# EAGLE design Pi3-Motherboard (EAGLE 7.6.0)

## Sheet 1 of 5
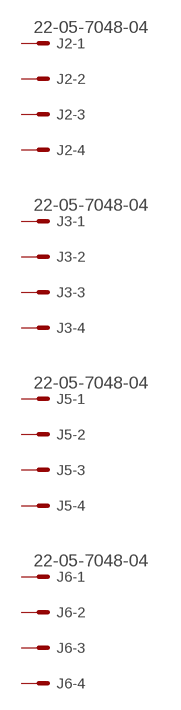
[diagram p0: schematic, sheet 1]

### Parts
J2  22-05-7048-04  [7395-04]
J3  22-05-7048-04  [7395-04]
J5  22-05-7048-04  [7395-04]
J6  22-05-7048-04  [7395-04]
Unconnected: J2.1 J2.2 J2.3 J2.4 J3.1 J3.2 J3.3 J3.4 J5.1 J5.2 J5.3 J5.4 J6.1 J6.2 J6.3 J6.4

## Sheet 2 of 5
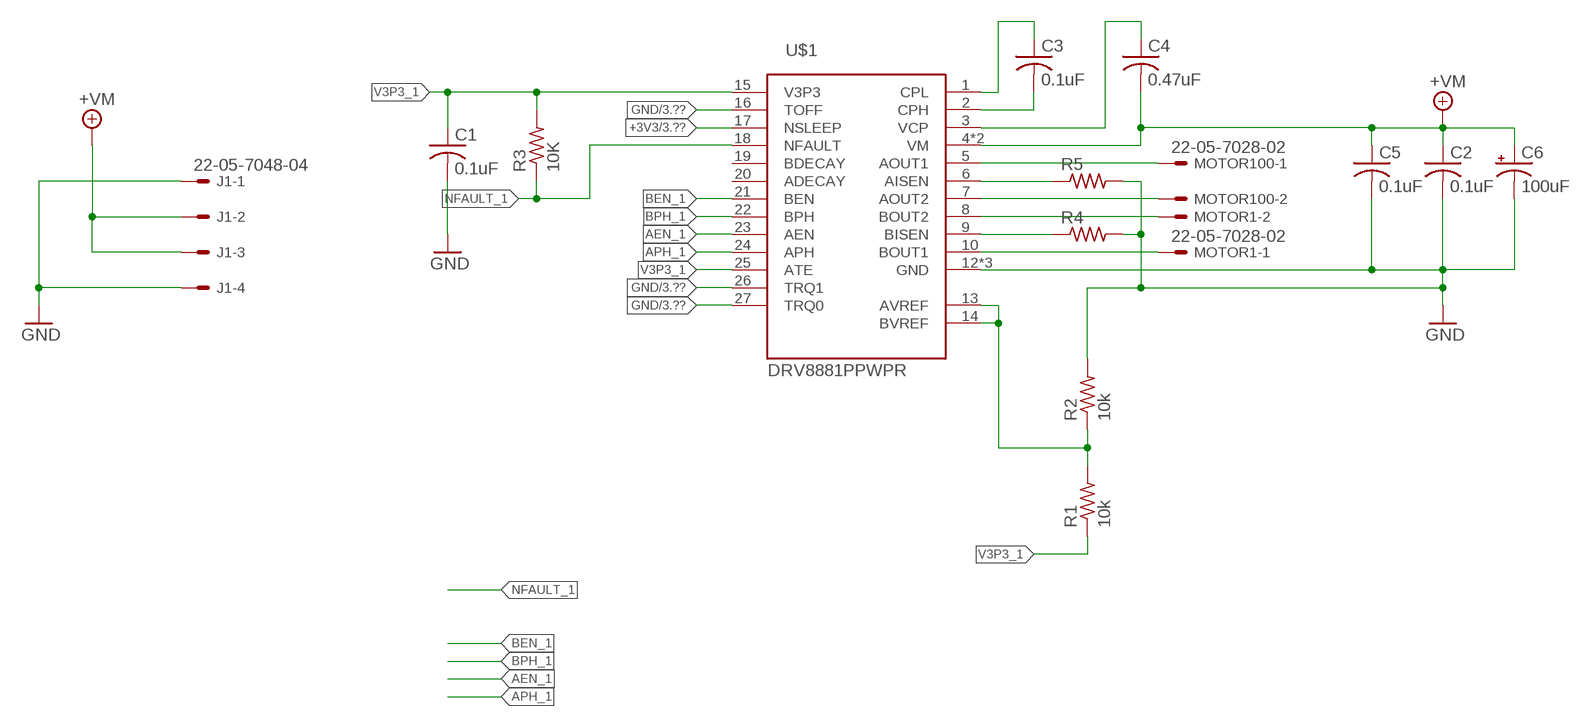
[diagram p1: schematic, sheet 2]

### Parts
C1  0.1uF  C-USC0402  [C0402]
C2  0.1uF  C-USC0402  [C0402]
C3  0.1uF  C-USC0402  [C0402]
C4  0.47uF  C-USC0402  [C0402]
C5  0.1uF  C-USC0402  [C0402]
C6  100uF  100UF-10V-10%(TANT)  [EIA7343]
J1  22-05-7048-04  [7395-04]
MOTOR1  22-05-7028-02  [7395-02]
MOTOR100  22-05-7028-02  [7395-02]
R1  10k  R-US_R0402  [R0402]
R2  10k  R-US_R0402  [R0402]
R3  10K  R-US_R1206  [R1206]
R4  R-US_R1206  [R1206]
R5  R-US_R1206  [R1206]
U$1  DRV8881PPWPR  [TSSOP-28]

### Nets
+3V3: U$1.17(NSLEEP) ; also sheet 3,4,5
+7V [VM]: C2.1 C4.2 C5.1 C6.A(+) J1.2 J1.3 U$1.4(VM) U$1.11(VM) ; supply symbol labelled +VM ; also sheet 3
AEN_1: U$1.23(AEN)
APH_1: U$1.24(APH)
BEN_1: U$1.21(BEN)
BPH_1: U$1.22(BPH)
GND: C1.2 C2.2 C5.2 C6.C(-) J1.1 J1.4 R2.2 R4.2 R5.2 U$1.12(GND) U$1.16(TOFF) U$1.26(TRQ1) U$1.27(TRQ0) U$1.28(GND) U$1.EXP(GND) ; also sheet 3,4,5
N$1: R4.1 U$1.9(BISEN)
N$2: R5.1 U$1.6(AISEN) ; also sheet 5
N$3: MOTOR100.1 U$1.5(AOUT1)
N$5: MOTOR100.2 U$1.7(AOUT2)
N$6: MOTOR1.2 U$1.8(BOUT2)
N$7: MOTOR1.1 U$1.10(BOUT1)
N$8: C3.2 U$1.2(CPH)
N$9: C3.1 U$1.1(CPL)
N$10: C4.1 U$1.3(VCP)
N$18: R1.2 R2.1 U$1.13(AVREF) U$1.14(BVREF)
NFAULT_1: R3.1 U$1.18(NFAULT)
V3P3_1: C1.1 R1.1 R3.2 U$1.15(V3P3) U$1.25(ATE)
Unconnected: U$1.19(BDECAY) U$1.20(ADECAY)

## Sheet 3 of 5
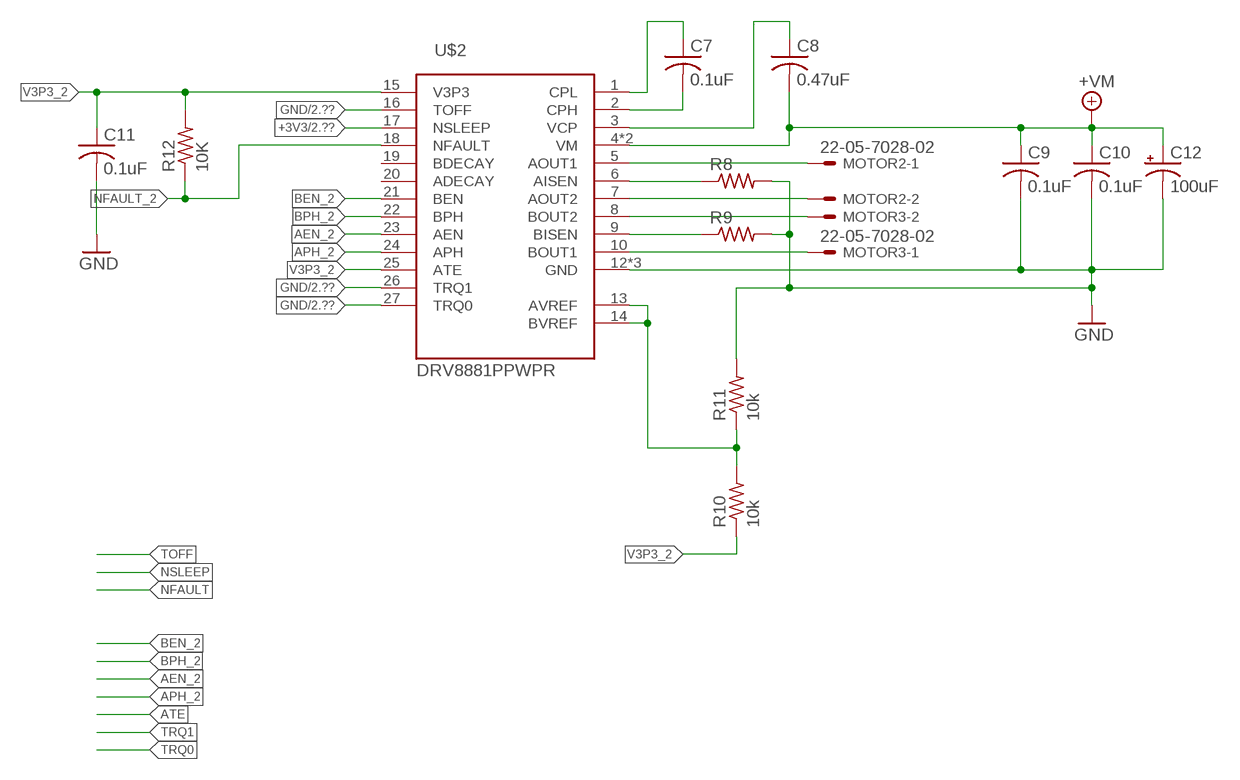
[diagram p2: schematic, sheet 3]

### Parts
C7  0.1uF  C-USC0402  [C0402]
C8  0.47uF  C-USC0402  [C0402]
C9  0.1uF  C-USC0402  [C0402]
C10  0.1uF  C-USC0402  [C0402]
C11  0.1uF  C-USC0402  [C0402]
C12  100uF  100UF-10V-10%(TANT)  [EIA7343]
MOTOR2  22-05-7028-02  [7395-02]
MOTOR3  22-05-7028-02  [7395-02]
R8  R-US_R1206  [R1206]
R9  R-US_R1206  [R1206]
R10  10k  R-US_R0402  [R0402]
R11  10k  R-US_R0402  [R0402]
R12  10K  R-US_R1206  [R1206]
U$2  DRV8881PPWPR  [TSSOP-28]

### Nets
+3V3: U$2.17(NSLEEP) ; also sheet 2,4,5
+7V [VM]: C8.2 C9.1 C10.1 C12.A(+) U$2.4(VM) U$2.11(VM) ; supply symbol labelled +VM ; also sheet 2
AEN_2: U$2.23(AEN)
APH_2: U$2.24(APH)
BEN_2: U$2.21(BEN)
BPH_2: U$2.22(BPH)
GND: C9.2 C10.2 C11.2 C12.C(-) R8.2 R9.2 R11.2 U$2.12(GND) U$2.16(TOFF) U$2.26(TRQ1) U$2.27(TRQ0) U$2.28(GND) U$2.EXP(GND) ; also sheet 2,4,5
N$4: R9.1 U$2.9(BISEN)
N$13: R8.1 U$2.6(AISEN)
N$14: MOTOR2.1 U$2.5(AOUT1)
N$15: MOTOR2.2 U$2.7(AOUT2)
N$16: MOTOR3.2 U$2.8(BOUT2)
N$17: MOTOR3.1 U$2.10(BOUT1)
N$19: C7.2 U$2.2(CPH)
N$20: C7.1 U$2.1(CPL)
N$21: C8.1 U$2.3(VCP)
N$22: R10.2 R11.1 U$2.13(AVREF) U$2.14(BVREF)
NFAULT_2: R12.1 U$2.18(NFAULT)
V3P3_2: C11.1 R10.1 R12.2 U$2.15(V3P3) U$2.25(ATE)
Unconnected: U$2.19(BDECAY) U$2.20(ADECAY)

## Sheet 4 of 5
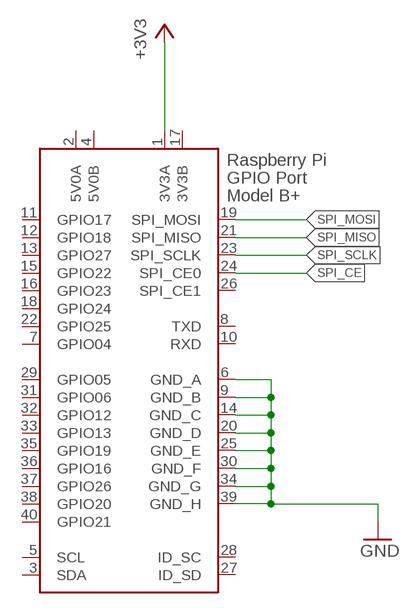
[diagram p3: schematic, sheet 4]

### Parts
X1  RASPI_BOARD_B+#_HD  [RASPI_BOARD_B+HAT_DF]

### Nets
+3V3: X1.1(3V3A) ; also sheet 2,3,5
GND: X1.6(GND_A) X1.9(GND_B) X1.14(GND_C) X1.20(GND_D) X1.25(GND_E) X1.30(GND_F) X1.34(GND_G) X1.39(GND_H) ; also sheet 2,3,5
SPI_CE: X1.24(SPI_CE0)
SPI_MISO: X1.21(SPI_MISO)
SPI_MOSI: X1.19(SPI_MOSI)
SPI_SCLK: X1.23(SPI_SCLK)
Unconnected: X1.3(SDA) X1.5(SCL) X1.7(GPIO04) X1.8(TXD) X1.10(RXD) X1.11(GPIO17) X1.12(GPIO18) X1.13(GPIO27) X1.15(GPIO22) X1.16(GPIO23) X1.18(GPIO24) X1.22(GPIO25) X1.26(SPI_CE1) X1.27(ID_SD) X1.28(ID_SC) X1.29(GPIO05) X1.31(GPIO06) X1.32(GPIO12) X1.33(GPIO13) X1.35(GPIO19) X1.36(GPIO16) X1.37(GPIO26) X1.38(GPIO20) X1.40(GPIO21)

## Sheet 5 of 5
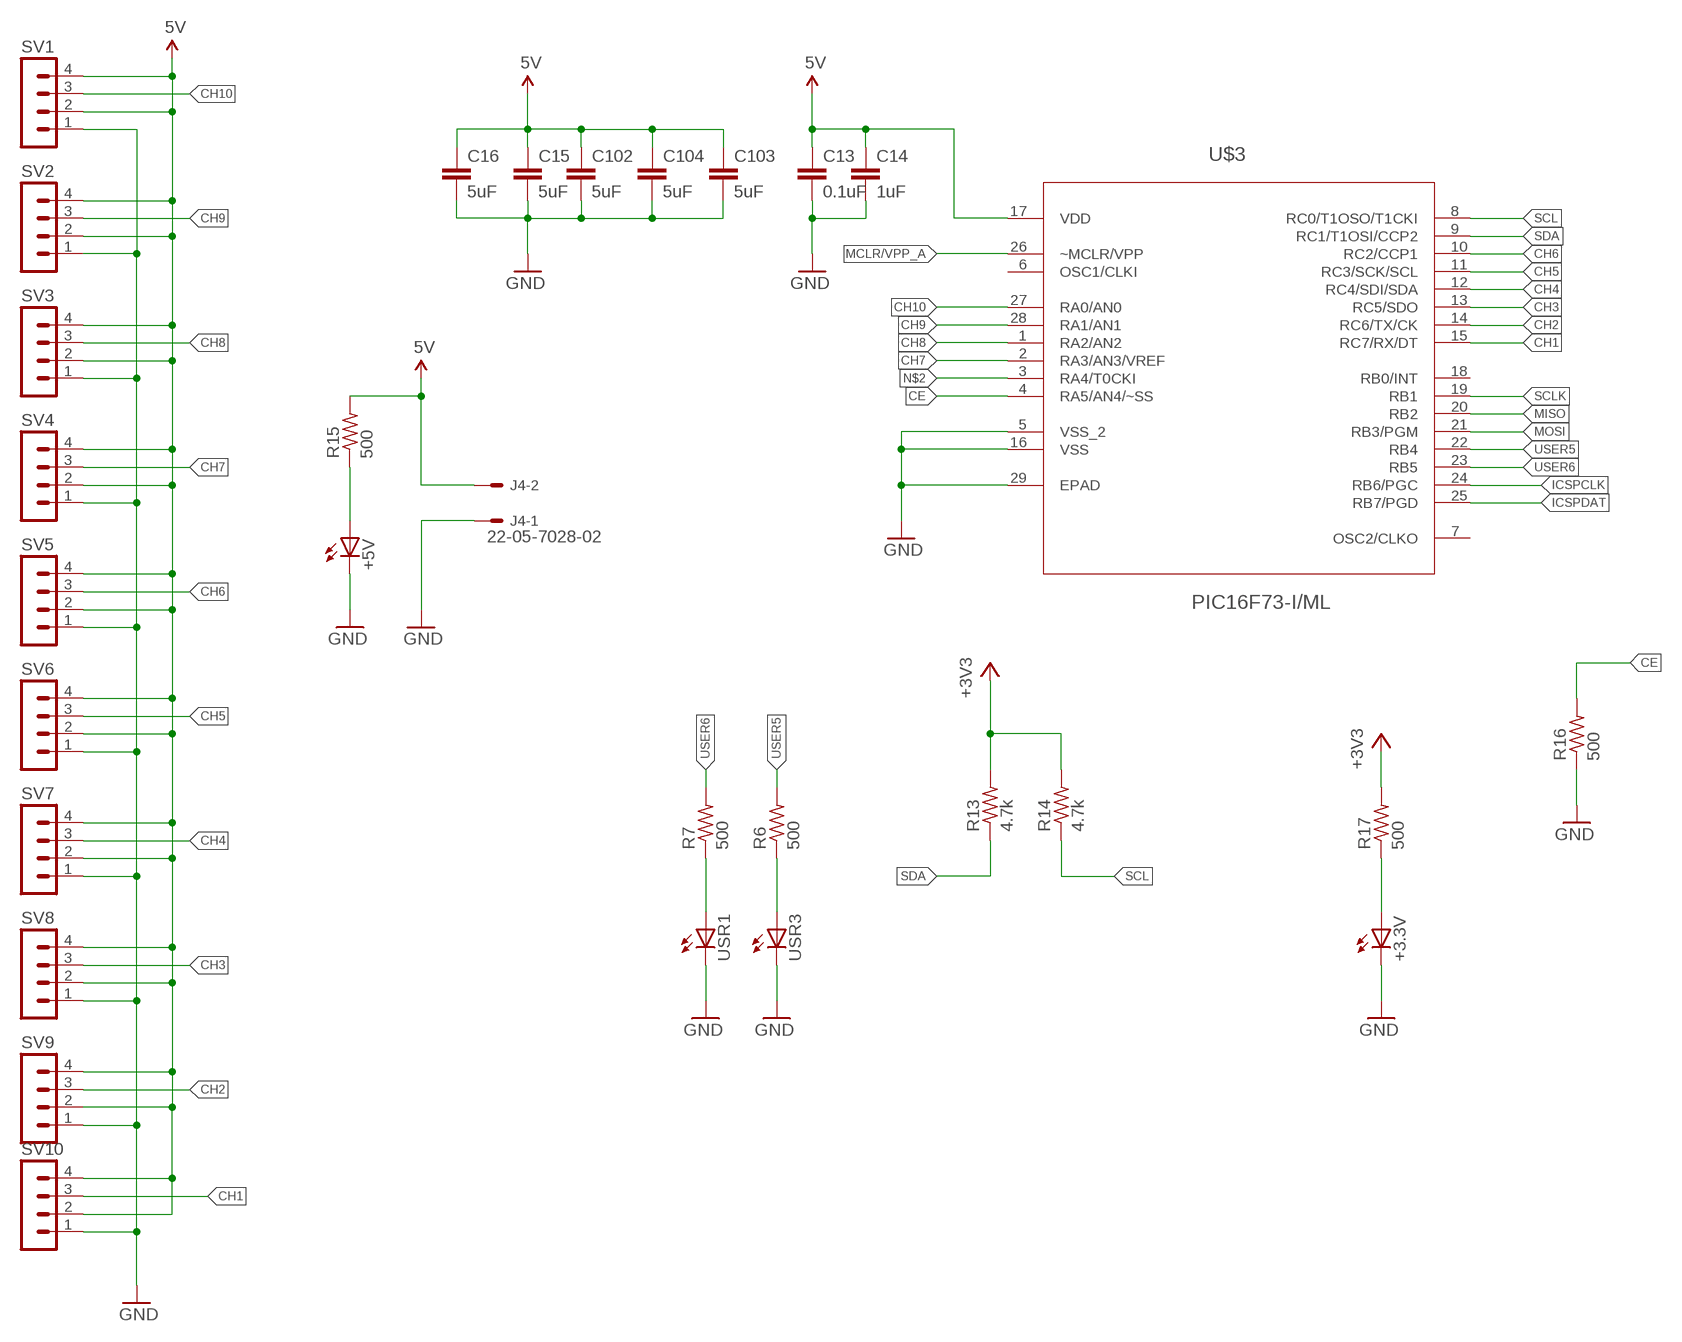
[diagram p4: schematic, sheet 5]

### Parts
+3.3V  LEDCHIP-LED0603  [CHIP-LED0603]
+5V  LEDCHIP-LED0603  [CHIP-LED0603]
C13  0.1uF  C-EUC0402  [C0402]
C14  1uF  C-EUC0402  [C0402]
C15  5uF  C-EUC0402  [C0402]
C16  5uF  C-EUC0402  [C0402]
C102  5uF  C-EUC0402  [C0402]
C103  5uF  C-EUC0402  [C0402]
C104  5uF  C-EUC0402  [C0402]
J4  22-05-7028-02  [7395-02]
R6  500  R-US_R0402  [R0402]
R7  500  R-US_R0402  [R0402]
R13  4.7k  R-US_R0402  [R0402]
R14  4.7k  R-US_R0402  [R0402]
R15  500  R-US_R0402  [R0402]
R16  500  R-US_R0402  [R0402]
R17  500  R-US_R0402  [R0402]
SV1  MA04-1  [MA04-1]
SV2  MA04-1  [MA04-1]
SV3  MA04-1  [MA04-1]
SV4  MA04-1  [MA04-1]
SV5  MA04-1  [MA04-1]
SV6  MA04-1  [MA04-1]
SV7  MA04-1  [MA04-1]
SV8  MA04-1  [MA04-1]
SV9  MA04-1  [MA04-1]
SV10  MA04-1  [MA04-1]
U$3  PIC16F73-I/ML  [QFN65P600X600X100-28N]
USR1  LEDCHIP-LED0603  [CHIP-LED0603]
USR3  LEDCHIP-LED0603  [CHIP-LED0603]

### Nets
5V: C13.1 C14.1 C15.1 C16.1 C102.1 C103.1 C104.1 J4.2 R15.2 SV1.2 SV1.4 SV2.2 SV2.4 SV3.2 SV3.4 SV4.2 SV4.4 SV5.2 SV5.4 SV6.2 SV6.4 SV7.2 SV7.4 SV8.2 SV8.4 SV9.2 SV9.4 SV10.2 SV10.4 U$3.17(VDD)
+3V3: R13.2 R14.2 R17.2 ; also sheet 2,3,4
CE: R16.2 U$3.4(RA5/AN4/~SS)
CH1: SV10.3 U$3.15(RC7/RX/DT)
CH2: SV9.3 U$3.14(RC6/TX/CK)
CH3: SV8.3 U$3.13(RC5/SDO)
CH4: SV7.3 U$3.12(RC4/SDI/SDA)
CH5: SV6.3 U$3.11(RC3/SCK/SCL)
CH6: SV5.3 U$3.10(RC2/CCP1)
CH7: SV4.3 U$3.2(RA3/AN3/VREF)
CH8: SV3.3 U$3.1(RA2/AN2)
CH9: SV2.3 U$3.28(RA1/AN1)
CH10: SV1.3 U$3.27(RA0/AN0)
GND: +3.3V.C +5V.C C13.2 C14.2 C15.2 C16.2 C102.2 C103.2 C104.2 J4.1 R16.1 SV1.1 SV2.1 SV3.1 SV4.1 SV5.1 SV6.1 SV7.1 SV8.1 SV9.1 SV10.1 U$3.5(VSS_2) U$3.16(VSS) U$3.29(EPAD) USR1.C USR3.C ; also sheet 2,3,4
ICSPCLK: U$3.24(RB6/PGC)
ICSPDAT: U$3.25(RB7/PGD)
MCLR/VPP_A: U$3.26(~MCLR/VPP)
MISO: U$3.20(RB2)
MOSI: U$3.21(RB3/PGM)
N$2: U$3.3(RA4/T0CKI) ; also sheet 2
N$11: R6.1 USR3.A
N$12: R7.1 USR1.A
N$23: +5V.A R15.1
N$24: +3.3V.A R17.1
SCL: R14.1 U$3.8(RC0/T1OSO/T1CKI)
SCLK: U$3.19(RB1)
SDA: R13.1 U$3.9(RC1/T1OSI/CCP2)
USER5: R6.2 U$3.22(RB4)
USER6: R7.2 U$3.23(RB5)
Unconnected: U$3.6(OSC1/CLKI) U$3.7(OSC2/CLKO) U$3.18(RB0/INT)

## Power pins joined to a net without a drawn wire
3V3B: X1.17(3V3B)
5V0A: X1.2(5V0A)
5V0B: X1.4(5V0B)

## Library data of the parts
+3.3V +5V USR1 USR3 = led:LED: LED OSRAM: - CHIPLED LG R971, LG N971, LY N971, LG Q971, LY Q971, LO R971, LY R971 LH N974, LH R974 LS Q976, LO Q976, LY Q976 LO Q996 - Hyper CHIPLED LW Q18S LB Q993, LB Q99A, LB R99A - SideLED LS A670, LO A670, LY A670, LG A670, LP A670 LB A673, LV A673, LT A673, LW A673 LH A674 LY A675 LS A676, LA A676, LO A676, LY A676, LW A676 LS A679, LY A679, LG A679 - Hyper Micro SIDELED® LS Y876, LA Y876, LO Y876, LY Y876 LT Y87S - SmartLED LW L88C, LW L88S LB L89C, LB L89S, LG L890 LS L89K, LO L89K, LY L89K LS L896, LA L896, LO L896, LY L896 - TOPLED LS T670, LO T670, LY T670, LG T670, LP T670 LSG T670, LSP T670, LSY T670, LOP T670, LYG T670 LG T671, LOG T671, LSG T671 LB T673, LV T673, LT T673, LW T673 LH T674 LS T676, LA T676, LO T676, LY T676, LB T676, LH T676, LSB T676, LW T676 LB T67C, LV T67C, LT T67C, LS T67K, LO T67K, LY T67K, LW E67C LS E67B, LA E67B, LO E67B, LY E67B, LB E67C, LV E67C, LT E67C LW T67C LS T679, LY T679, LG T679 LS T770, LO T770, LY T770, LG T770, LP T770 LB T773, LV T773, LT T773, LW T773 LH T774 LS E675, LA E675, LY E675, LS T675 LS T776, LA T776, LO T776, LY T776, LB T776 LHGB T686 LT T68C, LB T68C - Hyper Mini TOPLED® LB M676 - Mini TOPLED Santana® LG M470 LS M47K, LO M47K, LY M47K Source: http://www.osram.convergy.de LUXEON: - LUMILED® LXK2-PW12-R00, LXK2-PW12-S00, LXK2-PW14-U00, LXK2-PW14-V00 LXK2-PM12-R00, LXK2-PM12-S00, LXK2-PM14-U00 LXK2-PE12-Q00, LXK2-PE12-R00, LXK2-PE12-S00, LXK2-PE14-T00, LXK2-PE14-U00 LXK2-PB12-K00, LXK2-PB12-L00, LXK2-PB12-M00, LXK2-PB14-N00, LXK2-PB14-P00, LXK2-PB14-Q00 LXK2-PR12-L00, LXK2-PR12-M00, LXK2-PR14-Q00, LXK2-PR14-R00 LXK2-PD12-Q00, LXK2-PD12-R00, LXK2-PD12-S00 LXK2-PH12-R00, LXK2-PH12-S00 LXK2-PL12-P00, LXK2-PL12-Q00, LXK2-PL12-R00 Source: www.luxeon.com KINGBRIGHT: KA-3528ASYC Source: www.kingbright.com
C1-C5 C7-C11 = rcl:C-US: CAPACITOR, American symbol
C6 C12 = SparkFun-Capacitors:100UF-10V-10%(TANT): CAP-07890; PROD_ID: CAP-07890
C13-C16 C102-C104 = rcl:C-EU: CAPACITOR, European symbol
J1-J3 J5 J6 = con-molex:22-?-04: CONNECTOR wire to board 2.54 mm (.1 inch) pitch header; OC_FARNELL: unknown; OC_NEWARK: unknown
J4 = con-molex:22-?-02: CONNECTOR wire to board 2.54 mm (.1 inch) pitch header; OC_FARNELL: 9731601; OC_NEWARK: unknown
MOTOR1-MOTOR3 MOTOR100 = Son_of_Dark_Power:22-?-02: CONNECTOR wire to board 2.54 mm (.1 inch) pitch header; OC_FARNELL: 9731601; OC_NEWARK: unknown
R1-R5 R8-R12 = rcl:R-US_: RESISTOR, American symbol
R6 R7 R13-R17 = resistor:R-US_: RESISTOR, American symbol
SV1-SV10 = con-lstb:MA04-1: PIN HEADER; OC_FARNELL: unknown; OC_NEWARK: unknown
U$1 U$2 = motor-driver:DRV8881PPWPR
U$3 = Microchip_By_element14_Batch_1:PIC16F73-I/ML: 8-bit CMOS FLASH Microcontrollers; DESCRIPTION: 8-bit CMOS FLASH Microcontrollers; MPN: PIC16F73-I/ML; OC_FARNELL: 1084327; OC_NEWARK: 97K7368; PACKAGE: QFN-28; SUPPLIER: Microchip
X1 = Pi3_Power_hat_Rev1:RASPI_BOARD_B+#: Raspberry Pi GPIO connector with markings for the outer dimensions of the Raspberry Pi board model B+ with different sets of drill holes or mounting pads All pins connected

## Net classes
2 VM: width 0.254 mm, drill 0.33 mm, clearance 0.254 mm

## Board
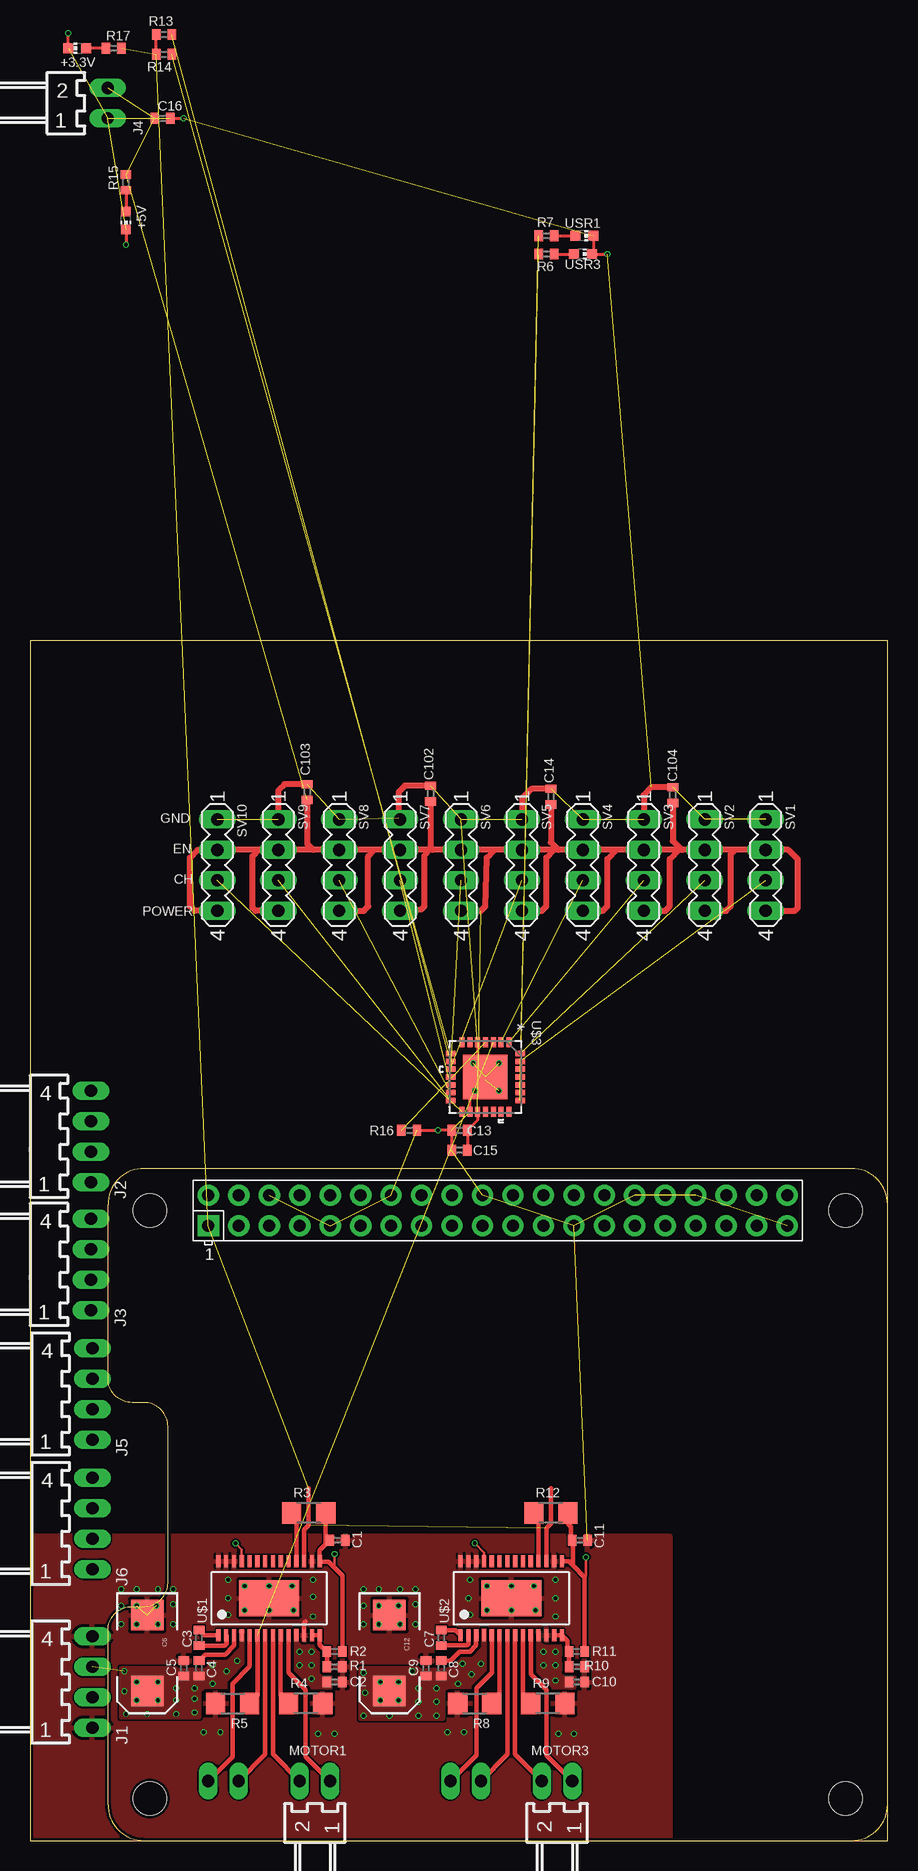
[diagram p5: board, top side]
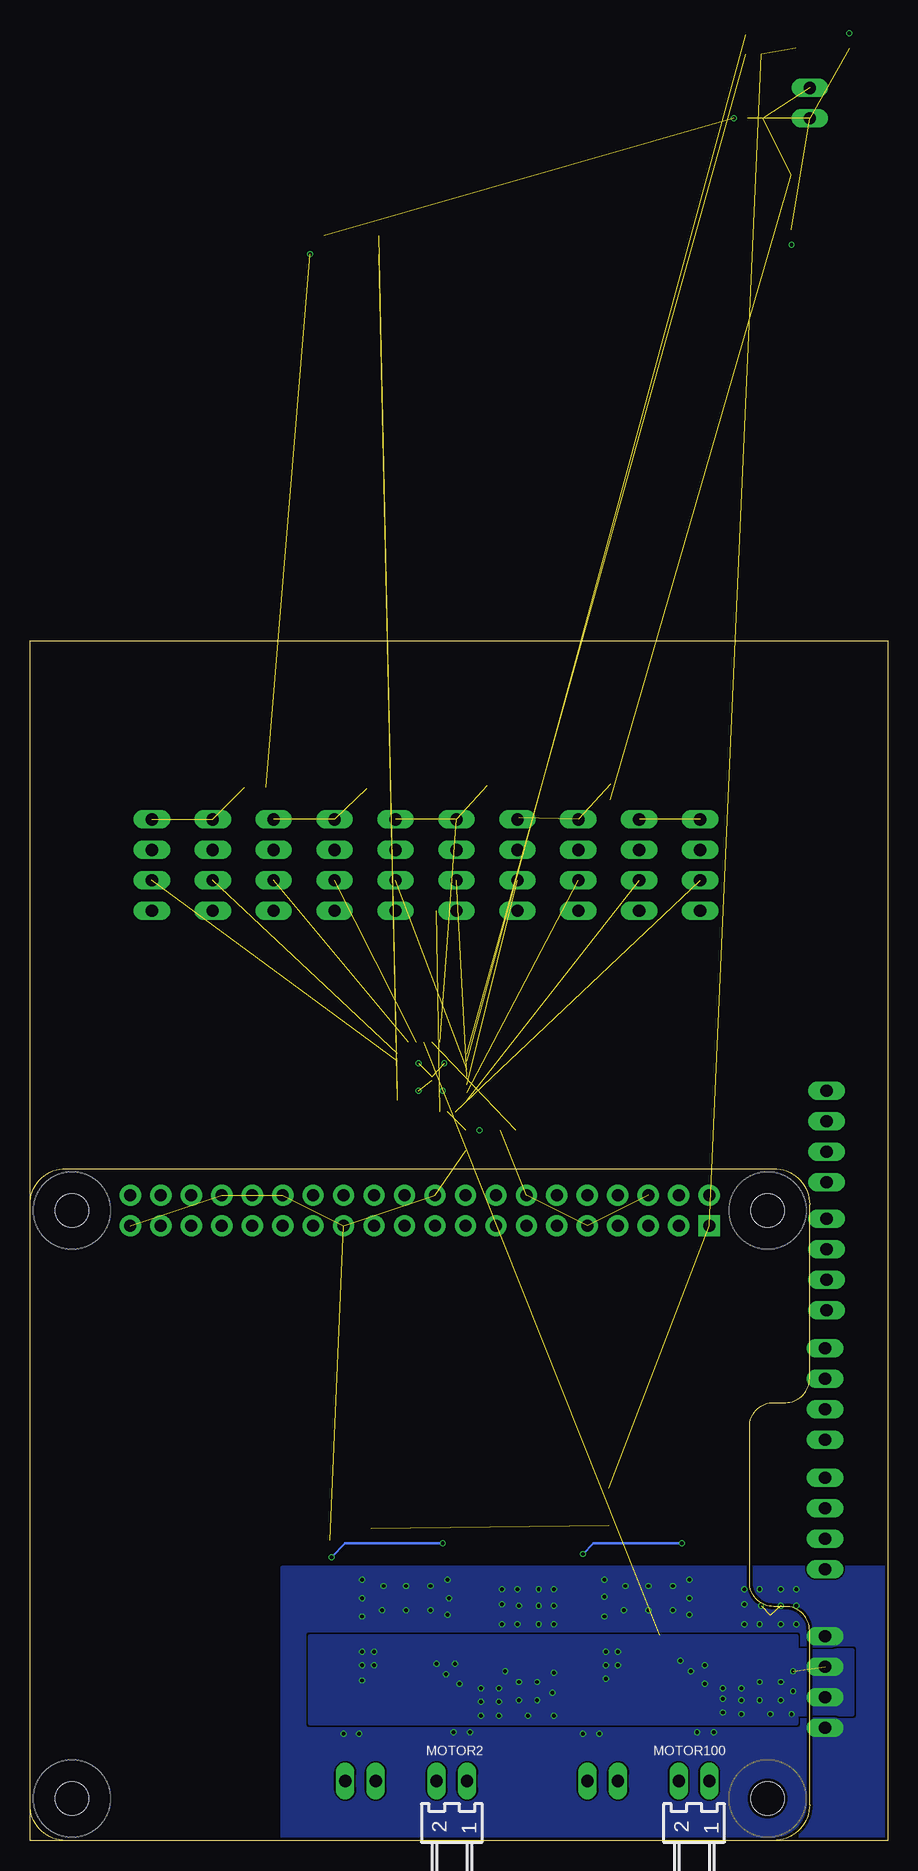
[diagram p6: board, bottom side, seen from below]

Size 71.5 x 100 mm. Coordinates in mm from the lower left corner, seen from the top.
Outline: 0,0 71.5,0 71.5,100 0,100 0,0
Copper layers (1*16): Top 0.035mm / dielectric 1.5mm / Bottom 0.035mm
Design rules "EagleRules-2-Layer-Shep": minimum track width 6mil, minimum drill 12mil, track to track 6mil, track to pad 6mil, pad to pad 6mil, via to via 6mil, smd to smd 0mil, copper to edge 10mil, drill to drill 10mil, minimum pad ring 2mil, minimum via ring 2mil, stop-mask expansion 2mil, vias tented up to drill 100mil, thermal gap 10mil

### Footprints (pad centres in the part's own frame; a part is rotated, then mirrored left to right if it is on the bottom)
CHIP-LED0603 = smd 0.8 x 0.8: A 0,-0.75; C 0,0.75
C0402 = smd 0.7 x 0.9: 1 -0.65,0; 2 0.65,0
EIA7343 = smd 2.55 x 2.7: A 3.17,0; C -3.17,0
7395-04 = drill 1.016 long: 1 3.81,0; 2 1.27,0; 3 -1.27,0; 4 -3.81,0
7395-02 = drill 1.016 long: 1 1.27,0; 2 -1.27,0
R0402 = smd 0.7 x 0.9: 1 -0.65,0; 2 0.65,0
R1206 = smd 1.6 x 1.803: 1 -1.422,0; 2 1.422,0
MA04-1 = drill 1.016 long: 1 -3.81,0; 2 -1.27,0; 3 1.27,0; 4 3.81,0
TSSOP-28 = smd 0.35 x 1: 1 -4.225,-3.087; 2 -3.575,-3.087; 3 -2.925,-3.087; 4 -2.275,-3.087; 5 -1.625,-3.087; 6 -0.975,-3.087; 7 -0.325,-3.087; 8 0.325,-3.087; 9 0.975,-3.087; 10 1.625,-3.087; 11 2.275,-3.087; 12 2.925,-3.087; 13 3.575,-3.087; 14 4.225,-3.087; 15 4.225,3.087; 16 3.575,3.087; 17 2.925,3.087; 18 2.275,3.087; 19 1.625,3.087; 20 0.975,3.087; 21 0.325,3.087; 22 -0.325,3.087; 23 -0.975,3.087; 24 -1.625,3.087; 25 -2.275,3.087; 26 -2.925,3.087; 27 -3.575,3.087; 28 -4.225,3.087 | smd 5 x 3: EXP 0,0
QFN65P600X600X100-28N = smd 0.813 x 0.432: 1 -2.896,1.956; 2 -2.896,1.295; 3 -2.896,0.66; 4 -2.896,0; 5 -2.896,-0.66; 6 -2.896,-1.295; 7 -2.896,-1.956; 15 2.896,-1.956; 16 2.896,-1.295; 17 2.896,-0.66; 18 2.896,0; 19 2.896,0.66; 20 2.896,1.295; 21 2.896,1.956 | smd 0.432 x 0.813: 8 -1.956,-2.896; 9 -1.295,-2.896; 10 -0.66,-2.896; 11 0,-2.896; 12 0.66,-2.896; 13 1.295,-2.896; 14 1.956,-2.896; 22 1.956,2.896; 23 1.295,2.896; 24 0.66,2.896; 25 0,2.896; 26 -0.66,2.896; 27 -1.295,2.896; 28 -1.956,2.896 | smd 3.708 x 3.708: 29 0,0
RASPI_BOARD_B+HAT_DF = drill 1 pad 1.778 square: 1 8.37,51.23 | drill 1 pad 1.778: 2 8.37,53.77; 3 10.91,51.23; 4 10.91,53.77; 5 13.45,51.23; 6 13.45,53.77; 7 15.99,51.23; 8 15.99,53.77; 9 18.53,51.23; 10 18.53,53.77; 11 21.07,51.23; 12 21.07,53.77; 13 23.61,51.23; 14 23.61,53.77; 15 26.15,51.23; 16 26.15,53.77; 17 28.69,51.23; 18 28.69,53.77; 19 31.23,51.23; 20 31.23,53.77; 21 33.77,51.23; 22 33.77,53.77; 23 36.31,51.23; 24 36.31,53.77; 25 38.85,51.23; 26 38.85,53.77; 27 41.39,51.23; 28 41.39,53.77; 29 43.93,51.23; 30 43.93,53.77; 31 46.47,51.23; 32 46.47,53.77; 33 49.01,51.23; 34 49.01,53.77; 35 51.55,51.23; 36 51.55,53.77; 37 54.09,51.23; 38 54.09,53.77; 39 56.63,51.23; 40 56.63,53.77 | hole 2.75: 3.5,3.5; 3.5,52.5; 61.5,3.5; 61.5,52.5

### Placement (x,y rotation side)
+3.3V  3.94,149.35 90 top  (outside the outline)
+5V  8,135 180 top  (outside the outline)
C1  25.65,25.02 0 top
C2  25.4,13.21 0 top
C3  14.1,16.89 270 top
C4  14.1,14.35 270 top
C5  12.83,14.35 90 top
C6  9.78,15.62 270 top
C7  34.29,16.89 270 top
C8  34.29,14.35 270 top
C9  33.02,14.35 90 top
C10  45.59,13.21 0 top
C11  45.85,25.02 0 top
C12  29.97,15.62 270 top
C13  35.81,59.18 180 top
C14  43.43,87 90 top
C15  35.81,57.53 180 top
C16  11.05,143.51 0 top  (outside the outline)
C102  33.4,87.25 90 top
C103  23.11,87.38 90 top
C104  53.59,87.12 90 top
J1  5.21,13.21 270 top
J2  5.08,58.67 270 top
J3  5.08,48.01 270 top
J4  6.48,144.78 270 top  (outside the outline)
J5  5.21,37.21 270 top
J6  5.21,26.42 270 top
MOTOR1  23.75,4.95 0 top
MOTOR2  36.32,4.95 0 bottom
MOTOR3  43.94,4.95 0 top
MOTOR100  16.13,4.95 0 bottom
R1  25.4,15.75 180 top
R2  25.4,14.48 0 top
R3  23.24,27.3 0 top
R4  22.99,11.43 0 top
R5  16.89,11.43 180 top
R6  43.05,132.21 180 top  (outside the outline)
R7  43.05,133.73 180 top  (outside the outline)
R8  37.08,11.43 180 top
R9  43.18,11.43 0 top
R10  45.59,15.75 180 top
R11  45.59,14.48 0 top
R12  43.43,27.3 0 top
R13  11.18,150.5 180 top  (outside the outline)
R14  11.18,148.84 180 top  (outside the outline)
R15  8,138.18 90 top  (outside the outline)
R16  31.62,59.18 180 top
R17  6.99,149.35 0 top  (outside the outline)
SV1  61.34,81.28 270 top
SV2  56.26,81.28 270 top
SV3  51.18,81.28 270 top
SV4  46.1,81.28 270 top
SV5  41.02,81.28 270 top
SV6  35.94,81.28 270 top
SV7  30.86,81.28 270 top
SV8  25.78,81.28 270 top
SV9  20.7,81.28 270 top
SV10  15.62,81.28 270 top
U$1  19.94,20.19 0 top
U$2  40.13,20.19 0 top
U$3  37.97,63.63 270 top
USR1  46.23,133.73 270 top  (outside the outline)
USR3  46.1,132.21 270 top  (outside the outline)
X1  6.5,0 0 top

### Tracks (layer width: path | path; a pad name or v marks a point on that pad's centre or on a via)
5V  (4 unrouted)
  Top 0.254: U$3.17 37.31,60.03 C13.1 C15.1
  Top 0.508: 58.8,82.55 SV1.2 63.25,82.55 64.01,81.79 64.01,77.72 63.75,77.47 SV1.4 | 58.8,82.55 SV2.2 54.36,82.55 | 54.36,82.55 54.1,82.55 | 54.1,82.55 SV3.2 48.9,82.55 | 48.9,82.55 SV4.2 44.07,82.55 | 44.07,82.55 43.69,82.55 | 43.69,82.55 SV5.2 38.73,82.55 | 38.73,82.55 SV6.2 33.53,82.55 | 33.53,82.55 33.27,82.55 | 33.27,82.55 SV7.2 28.7,82.55 | 28.7,82.55 SV8.2 23.62,82.55 | 23.62,82.55 SV9.2 19.05,82.55 | 19.05,82.55 SV10.2 13.97,82.55 13.34,81.92 13.34,77.85 13.72,77.47 SV10.4 | SV2.4 58.04,77.47 58.42,77.85 58.42,82.17 58.8,82.55 | SV3.4 52.96,77.47 53.34,77.85 53.34,81.79 54.1,82.55 | SV4.4 47.75,77.47 48.13,77.85 48.13,81.79 48.9,82.55 | SV5.4 42.67,77.47 43.05,77.85 43.05,81.92 43.69,82.55 | SV6.4 37.59,77.47 37.97,77.85 38.1,81.92 38.73,82.55 | SV7.4 32.64,77.6 32.89,77.85 32.89,82.04 33.27,82.55 | SV8.4 27.81,77.47 28.19,77.85 28.19,82.04 28.7,82.55 | SV9.4 18.8,77.47 18.54,77.72 18.54,82.04 19.05,82.55 | C104.1 53.59,83.31 54.36,82.55 | C14.1 43.43,83.19 44.07,82.55 | C102.1 33.4,82.68 33.53,82.55 | C103.1 23.11,83.06 23.62,82.55
+3V3  (4 unrouted)
  Top 0.254: R14.2 R13.2
  Top 0.356: U$1.17 22.86,25.91 23.24,26.29 23.24,29.34 | U$2.17 43.06,26.04 43.43,26.42 43.43,29.34
+7V  (via drill 0.33)  (1 unrouted)
  other vias: 8,10.54 9.78,10.54 12.19,10.54 12.19,12.7 12.19,11.68 13.72,12.7 13.72,11.81 13.72,10.67 15.24,13.08 15.24,14.61 17.27,14.99 16.38,14.1 22.48,15.75 22.48,14.61 23.5,15.75 23.5,14.61 23.5,13.46 27.81,10.41 29.97,10.41 32.38,10.41 32.38,11.56 32.38,12.7 33.91,12.7 33.91,11.56 33.91,10.41 27.81,13.97 27.94,12.32 29.21,11.68 29.21,13.21 30.73,13.21 30.73,11.68 31.88,14.1 35.69,13.08 36.07,14.73 37.59,14.73 36.83,13.84 42.8,15.75 43.81,15.75 43.81,14.61 42.8,14.61 43.81,13.34 7.87,12.45 7.87,14.1 8.89,13.21 10.67,13.21 10.67,11.68 8.89,11.68
  pour Top (no thermals): 21.84,17.53 22.23,17.53 22.23,16.38 25.02,16.26 25.02,12.7 21.84,12.7
  pour Top (no thermals): 17.14,17.4 17.14,16.13 16.26,15.24 15.11,15.24 14.22,14.35 7.62,14.35 7.62,10.29 14.1,10.29 14.1,12.45 14.48,12.83 18.16,12.83 18.54,13.21 18.54,17.4
  pour Bottom (no thermals): 7.62,17.02 48.13,17.02 48.13,9.78 7.62,9.78
  pour Top (no thermals): 37.47,17.53 37.47,16.38 35.18,14.35 27.56,14.35 27.56,10.16 34.42,10.16 34.42,12.45 34.8,12.83 38.73,12.83 38.73,17.53
  pour Top (no thermals): 41.15,17.4 42.42,17.4 42.42,16.38 44.96,16.38 45.34,16 45.34,12.7 41.15,12.7
  pour Bottom (no thermals): 7.62,15.88 2.92,15.88 2.92,10.54 7.62,10.54
CE  (1 unrouted)
CH1  (1 unrouted)
CH2  (1 unrouted)
CH3  (1 unrouted)
CH4  (1 unrouted)
CH5  (1 unrouted)
CH6  (1 unrouted)
CH7  (1 unrouted)
CH8  (1 unrouted)
CH9  (1 unrouted)
CH10  (1 unrouted)
GND  (via drill 0.33)  (30 unrouted)
  Top 0.254: U$3.16 36.68,62.08 v37.08,62.48 | U$3.5 37.31,65.13 v36.96,64.77 | v48.13,132.21 USR3.C 46.98,132.33 USR1.C | C15.2 C13.2 v34.04,59.18 R16.1 | C16.2 v12.83,143.51 | +5V.C v8,132.97 | +3.3V.C 3.17,149.36 v3.17,150.62
  Top 0.356: U$1.12 22.86,18.16 22.99,18.29
  Top 0.508: U$3.29 37.97,63.37 v37.08,62.48 | C14.2 41.8,87.64 41.02,86.87 SV5.1 | C102.2 31.26,87.9 30.73,87.38 30.73,85.22 SV7.1 | C103.2 21.22,88.03 20.7,87.5 SV9.1 | C104.2 51.83,87.77 51.18,87.12 SV3.1
  other vias: 16.51,18.8 16.51,20.19 16.51,21.72 23.62,21.72 23.62,20.32 23.62,18.67 21.84,21.21 21.97,19.18 17.91,19.18 17.91,21.21 19.94,21.21 19.94,19.18 10.67,18.03 8.89,18.03 8.89,19.56 10.54,19.56 11.94,18.03 11.94,19.68 11.94,20.95 10.67,20.95 8.89,20.95 7.62,20.95 7.62,19.56 7.62,18.03 30.86,18.03 29.08,18.03 29.08,19.56 30.73,19.56 32.13,18.03 32.13,19.68 32.13,20.95 30.86,20.95 29.08,20.95 27.81,20.95 27.81,19.56 27.81,18.03 36.7,18.8 43.81,18.67 42.16,19.18 38.1,19.18 40.13,19.18 36.7,21.72 43.81,21.72 42.04,21.21 38.1,21.21 40.13,21.21 36.58,20.19 43.81,20.19 14.48,9.02 15.88,9.02 24,8.89 25.4,8.89 34.8,9.02 36.2,9.02 44.07,8.89 45.34,8.89 39.12,64.77 39.12,62.48
  pour Top (rank 6): 53.34,0 0,0 0,25.4 53.34,25.4
  pour Bottom (rank 6, no thermals): 0,22.73 50.42,22.73 50.42,0.13 0,0.13
N$1
  Top 0.356: U$1.9 20.91,12.08 R4.1
N$2  (1 unrouted)
  Top 0.356: U$1.6 18.96,12.08 R5.1
N$3
  Top 0.356: U$1.5 18.31,14.5 16.89,13.08 16.89,6.99 MOTOR100.1
N$4
  Top 0.356: U$2.9 41.11,12.08 R9.1
N$5
  Top 0.356: U$1.7 19.61,7.17 MOTOR100.2
N$6
  Top 0.356: U$1.8 20.26,7.17 MOTOR1.2
N$7
  Top 0.356: U$1.10 21.56,14 22.99,12.57 22.99,6.99 MOTOR1.1
N$8
  Top 0.356: C3.2 16.24,16.24 16.38,16.38 16.38,17.09 U$1.2
N$9
  Top 0.356: U$1.1 14.53,17.11 C3.1
N$10
  Top 0.356: U$1.3 17.01,16.25 16.26,15.49 14.59,15.49 C4.1
N$11
  Top 0.254: R6.1 USR3.A
N$12
  Top 0.254: R7.1 USR1.A
N$13
  Top 0.356: U$2.6 39.16,12.08 R8.1
N$14
  Top 0.356: U$2.5 38.51,14 37.21,12.7 37.21,7.11 MOTOR2.1
N$15
  Top 0.356: U$2.7 39.81,7.17 MOTOR2.2
N$16
  Top 0.356: U$2.8 40.46,7.17 MOTOR3.2
N$17
  Top 0.356: U$2.10 41.76,13.87 43.05,12.57 43.05,7.11 MOTOR3.1
N$18
  Top 0.356: U$1.13 U$1.14 24.16,16.33 R1.2 R2.1
N$19
  Top 0.356: U$2.2 36.56,16.36 36.45,16.26 34.3,16.26 C7.2
N$20
  Top 0.356: U$2.1 35.47,17.54 C7.1
N$21
  Top 0.356: U$2.3 37.21,16.25 36.7,15.75 35.81,15.75 35.05,14.99 34.3,14.99 C8.1
N$22
  Top 0.356: R11.1 R10.2 44.83,15.86 44.83,16.64 U$2.14 U$2.13
N$23
  Top 0.254: R15.1 +5V.A
N$24
  Top 0.254: R17.1 +3.3V.A
NFAULT_1
  Top 0.356: U$1.18 22.21,26.91 R3.1
NFAULT_2
  Top 0.356: U$2.18 42.41,26.91 R12.1
SCL  (1 unrouted)
SDA  (1 unrouted)
USER5  (1 unrouted)
USER6  (1 unrouted)
V3P3_1  (via drill 0.33)
  Top 0.203: U$1.25 17.66,24.25 v17.14,24.77 | v25.4,23.88 25.4,22.73 25.65,22.48
  Top 0.356: R1.1 26.05,22.08 25.65,22.48 24.89,23.24 24.2,23.24 U$1.15 24.16,24.18 24.66,24.68 | 24.66,24.68 C1.1 | R3.2 24.66,24.68
  Bottom 0.203: v17.14,24.77 24.51,24.77 v25.4,23.88
V3P3_2  (via drill 0.33)
  Top 0.203: U$2.25 37.86,23.99 v37.08,24.77 | v46.35,23.62 46.35,22.07 46.24,21.96
  Top 0.356: U$2.15 44.92,23.28 45.28,22.92 | 45.28,22.92 46.24,21.96 R10.1 | 45.28,22.92 45.28,24.94 C11.1 45.09,25.13 45.09,26.16 44.86,26.39 R12.2
  Bottom 0.203: v37.08,24.77 45.21,24.77 v46.35,23.62

### Text on the board
tPlace: GND | EN | CH | POWER